# EAGLE design Tracksoar v2 flash (EAGLE 9.0.0)
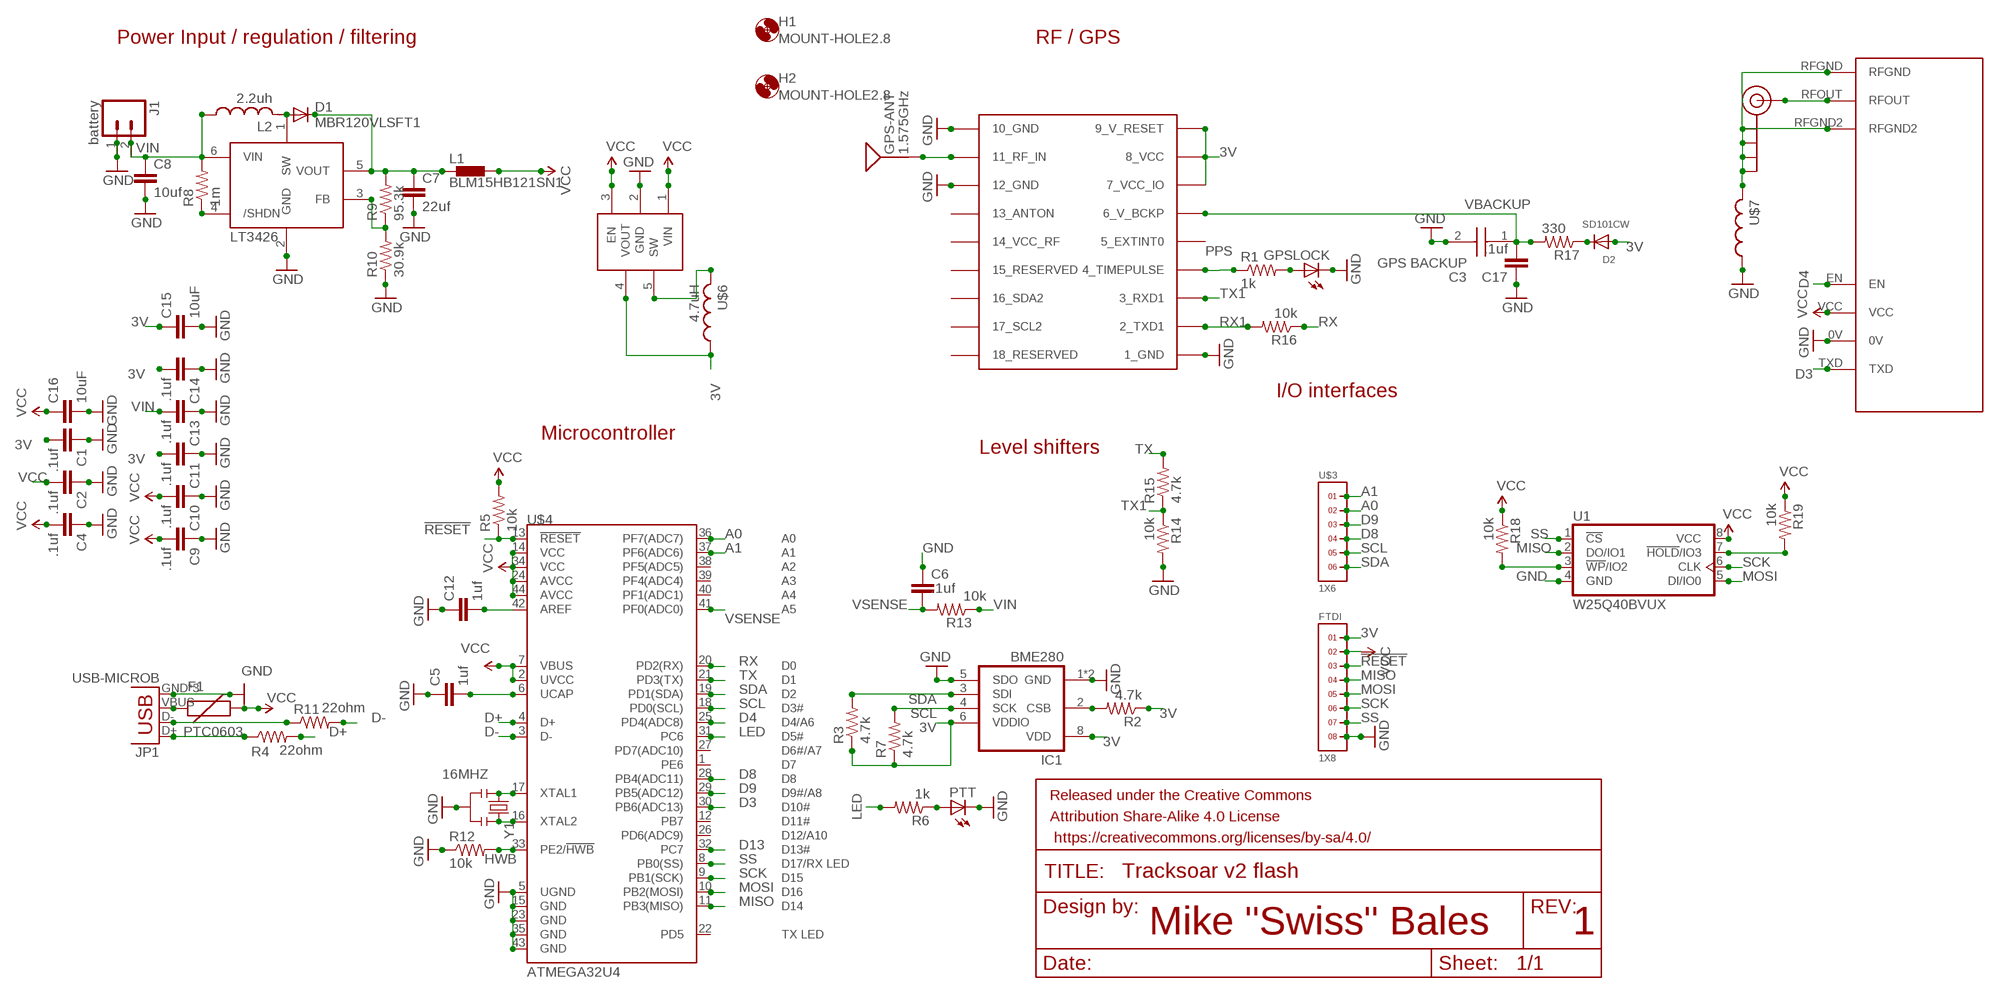
[diagram p0: schematic, sheet 1]

## Parts
C1  .1uf  CAP0402-CAP  [0402-CAP]
C2  .1uf  CAP0402-CAP  [0402-CAP]
C3  GPS BACKUP  DSK-3R3H204T614-H2L  [DSK-3R3H204T614-H2L]
C4  .1uf  CAP0402-CAP  [0402-CAP]
C5  1uf  CAP0402-CAP  [0402-CAP]
C6  .1uf  CAP0402-CAP  [0402-CAP]
C7  22uf  CAP0805  [0805]
C8  10uf  CAP0805  [0805]
C9  .1uf  CAP0402-CAP  [0402-CAP]
C10  .1uf  CAP0402-CAP  [0402-CAP]
C11  .1uf  CAP0402-CAP  [0402-CAP]
C12  1uf  CAP0402-CAP  [0402-CAP]
C13  .1uf  CAP0402-CAP  [0402-CAP]
C14  .1uf  CAP0402-CAP  [0402-CAP]
C15  10uF  10UF-0603-6.3V-20%  [0603]
C16  10uF  10UF-0603-6.3V-20%  [0603]
C17  .1uf  CAP0402-CAP  [0402-CAP]
D1  MBR120VLSFT1  DIODE-SOD123  [SOD123]
D2  SD101CW  DIODESOD-123  [SOD-123]
F1  PTC0603  [0603]
FRAME1  FRAME-LETTER  [CREATIVE_COMMONS]
FTDI  1X8  [1X8]
GPS-ANT  1.575GHz  ANTENNAGPS-2X7MM  [ANT-GPS-2X7MM]
GPSLOCK  LEDCHIP-LED0603  [CHIP-LED0603]
H1  MOUNT-HOLE2.8  [2,8]
H2  MOUNT-HOLE2.8  [2,8]
IC1  BME280  [BME280]
J1  battery  M02JST-PTH-2  [JST-2-PTH]
J$1  SMA_EDGE  [SMA-EDGE]
JP1  USB-MICROB  [USB-MICROB]
L1  BLM15HB121SN1  [0402]
L2  2.2uh  L-USL1812  [L1812]
LT3426  LT3426  [SOT23-6]
PTT  LEDCHIP-LED0603  [CHIP-LED0603]
R1  1k  R-US_R0402  [R0402]
R2  4.7k  R-US_R0402  [R0402]
R3  4.7k  R-US_R0402  [R0402]
R4  22ohm  R-US_R0402  [R0402]
R5  10k  R-US_R0402  [R0402]
R6  1k  R-US_R0402  [R0402]
R7  4.7k  R-US_R0402  [R0402]
R8  1m  R-US_R0402  [R0402]
R9  95.3k  R-US_R0402  [R0402]
R10  30.9k  R-US_R0402  [R0402]
R11  22ohm  R-US_R0402  [R0402]
R12  10k  R-US_R0402  [R0402]
R13  10k  R-US_R0402  [R0402]
R14  10k  R-US_R0402  [R0402]
R15  4.7k  R-US_R0402  [R0402]
R16  10k  R-US_R0402  [R0402]
R17  330  R-US_R0402  [R0402]
R18  10k  R-US_R0402  [R0402]
R19  10k  R-US_R0402  [R0402]
U1  W25Q40BVUX  [USON8]
U$1  UBLOX_MAX  [UBLOX_MAX]
U$2  RADIOMETRIX-HX1  [RADIOMETRIX-HX1]
U$3  1X6  [1X6]
U$4  ATMEGA32U4  ATMEGA32U4QFN2  [QFN-44-NOPAD]
U$5  PAM2305  PAM2305-33SOT23-5  [DBV_R-PDSO-G5]
U$6  4.7uH  INDUCTOR_0805_N  [RESC0805_N]
U$7  INDUCTOR_0402_N  [RESC0402_N]
Y1  16MHZ  RESONATOR16MHZ  [RESONATOR-SMD]

## Nets
3V: C1.2 C11.2 C14.2 C15.1 D2.A FTDI.1 IC1.6(VDDIO) IC1.8(VDD) R2.1 R3.1 R7.1 U$1.7_VCC_IO U$1.8_VCC U$1.9_V_RESET U$5.4(VOUT) U$6.1
!RESET: FTDI.3 R5.1 U$4.13(!RESET)
A0: U$3.2 U$4.36(PF7(ADC7))
A1: U$3.1 U$4.37(PF6(ADC6))
D3: U$2.TXD U$4.30(PB6(ADC13))
D4: U$2.EN U$4.25(PD4(ADC8))
D8: U$3.4 U$4.28(PB4(ADC11))
D9: U$3.3 U$4.29(PB5(ADC12))
D13: U$4.32(PC7)
D+: R4.2 U$4.4(D+)
D-: R11.2 U$4.3(D-)
GND: C1.1 C2.1 C3.2(-) C4.1 C5.1 C6.1 C7.2 C8.2 C9.1 C10.1 C11.1 C12.1 C13.1 C14.1 C15.2 C16.2 C17.1 FTDI.8 GPSLOCK.C IC1.1(GND) IC1.5(SDO) IC1.7(GND) J1.1 JP1.GND JP1.MT1(GND) JP1.MT2(GND) LT3426.2(GND) PTT.C R10.1 R12.1 R14.2 U1.4(GND) U$1.1_GND U$1.10_GND U$1.12_GND U$2.0V U$4.5(UGND) U$4.15(GND) U$4.23(GND) U$4.35(GND) U$4.43(GND) U$5.2(GND) U$7.1 Y1.2
HWB: R12.2 U$4.33(PE2/!HWB)
LED: R6.2 U$4.31(PC6)
MISO: FTDI.4 U1.2(DO/IO1) U$4.11(PB3(MISO))
MOSI: FTDI.5 U1.5(DI/IO0) U$4.10(PB2(MOSI))
N$1: J$1.SIG(SIGNAL) U$2.RFOUT
N$2: IC1.2(CSB) R2.2
N$3: GPSLOCK.A R1.2
N$6: GPS-ANT.1(SIGNAL) U$1.11_RF_IN
N$7: JP1.D- R11.1
N$8: JP1.D+ R4.1
N$9: D1.A L2.2 LT3426.1(SW)
N$12: LT3426.4(/SHDN) R8.1
N$13: LT3426.3(FB) R9.1 R10.2
N$14: F1.1 JP1.VBUS
N$17: C12.2 U$4.42(AREF)
N$19: C7.1 D1.C L1.1 LT3426.5(VOUT) R9.2
N$20: C5.2 U$4.6(UCAP)
N$21: U$5.5(SW) U$6.2
N$22: D2.C R17.1
N$23: R18.2 U1.3(!WP!/IO2)
N$27: PTT.A R6.1
N$28: R19.2 U1.7(!HOLD!/IO3)
PPS: R1.1 U$1.4_TIMEPULSE
RFGND: J$1.GND@0(GND) J$1.GND@1(GND) J$1.GND@2(GND) J$1.GND@3(GND) U$2.RFGND U$2.RFGND2 U$7.2
RX: R16.1 U$4.20(PD2(RX))
RX1: R16.2 U$1.2_TXD1
SCK: FTDI.6 U1.6(CLK) U$4.9(PB1(SCK))
SCL: IC1.4(SCK) R7.2 U$3.5 U$4.18(PD0(SCL))
SDA: IC1.3(SDI) R3.2 U$3.6 U$4.19(PD1(SDA))
SS: FTDI.7 U1.1(!CS!) U$4.8(PB0(SS))
TX: R15.2 U$4.21(PD3(TX))
TX1: R14.1 R15.1 U$1.3_RXD1
VBACKUP: C3.1(+) C17.2 R17.2 U$1.6_V_BCKP
VCC: C2.2 C4.2 C9.2 C10.2 C16.1 F1.2 FTDI.2 L1.2 R5.2 R18.1 R19.1 U1.8(VCC) U$2.VCC U$4.2(UVCC) U$4.7(VBUS) U$4.14(VCC) U$4.24(AVCC) U$4.34(VCC) U$4.44(AVCC) U$5.1(VIN) U$5.3(EN)
VIN: C8.1 C13.2 J1.2 L2.1 LT3426.6(VIN) R8.2 R13.1
VSENSE: C6.2 R13.2 U$4.41(PF0(ADC0))
XTAL1: U$4.17(XTAL1) Y1.1
XTAL2: U$4.16(XTAL2) Y1.3
Unconnected: U$1.5_EXTINT0 U$1.13_ANTON U$1.14_VCC_RF U$1.15_RESERVED U$1.16_SDA2 U$1.17_SCL2 U$1.18_RESERVED U$4.1(PE6) U$4.12(PB7) U$4.22(PD5) U$4.26(PD6(ADC9)) U$4.27(PD7(ADC10)) U$4.38(PF5(ADC5)) U$4.39(PF4(ADC4)) U$4.40(PF1(ADC1))

## Notes on the sheet
- Power Input / regulation / filtering | RF / GPS
- I/O interfaces
- Microcontroller
- Level shifters
- Mike "Swiss" Bales | 1

## Library data of the parts
C1 C2 C4 C5 C7-C14 C17 = SparkFun-Capacitors:CAP: Capacitor Standard 0603 ceramic capacitor, and 0.1" leaded capacitor.
C3 = DSK-3R3H204T614-H2L:DSK-3R3H204T614-H2L: Coin cell capacitor Source: Datasheet <http://www.elna.co.jp/en/capacitor/double_layer/catalog/pdf/ds_e.pdf>; ARROW_PART_NUMBER: DSK-3R3H204T614-H2L; DESCRIPTION: Coin cell capacitor; HEIGHT: mm; MANUFACTURER_NAME: Elna; MANUFACTURER_PART_NUMBER: DSK-3R3H204T614-H2L
C6 = SparkFun-Passives:CAP: Capacitor Standard 0603 ceramic capacitor, and 0.1" leaded capacitor.
C15 C16 = SparkFun-Capacitors:10UF: 10.0µF ceramic capacitors A capacitor is a passive two-terminal electrical component used to store electrical energy temporarily in an electric field.; PROD_ID: CAP-11015
D1 = diode:DIODE-: DIODE
D2 = adafruit:DIODE: Diode SMADIODE - SMA Surface Mount Package 20V 1A Schottky Diode Digikey: 641-1014-6-ND DO-1N4148 - Through Hole Small Current Diode SOD-123 20V 1 A (.5mV Vf) Schottky Diode - Digikey: MBRX120TPMSCT-ND SOD-323 10V 570mA (.38mV Vf, 3ns) Schottky Diode - Digikey: ZLLS410CT-ND SOD-523 30V 30mA Schottky Diode (RB751S-40TE61) - Digikey: RB751S-40TE61CT-ND SOT23-R/W - SOT23 Package (R = Solder Paste/Reflow Ovens, W = Hand-Soldering) BAT54Film 40V 300mA - Digikey: 497-7162-1-ND
F1 = SparkFun-PowerIC:PTC: Resettable Fuse PTC Resettable Fuse. Spark Fun Electronics SKU : COM-08357
FRAME1 = SparkFun-Aesthetics:FRAME-LETTER: Schematic Frame Standard 8.5x11 US Letter frame
FTDI = headers(2mm):1X8
GPS-ANT = SparkFun-GPS:ANTENNA: Single-ended Antennae 1.575GHz antennae with just one terminal. These are all chip antennae. 1575MHz (GPS) Antennae ANT-GPS-2X7MM - 2.0 x 7.0 mm chip antenna. (SparkFun Product <https://www.sparkfun.com/products/9131>) ANT-GPS-2X8MM - 2.0 x 8.0 mm chip antenna. (SparkFun Product <https://www.sparkfun.com/products/8418>); PROD_ID: ANT-09087; SF_ID: GPS-09131
GPSLOCK PTT = adafruit:LED: LED OSRAM: - CHIPLED LG R971, LG N971, LY N971, LG Q971, LY Q971, LO R971, LY R971 LH N974, LH R974 LS Q976, LO Q976, LY Q976 LO Q996 - Hyper CHIPLED LW Q18S LB Q993, LB Q99A, LB R99A - SideLED LS A670, LO A670, LY A670, LG A670, LP A670 LB A673, LV A673, LT A673, LW A673 LH A674 LY A675 LS A676, LA A676, LO A676, LY A676, LW A676 LS A679, LY A679, LG A679 - Hyper Micro SIDELED® LS Y876, LA Y876, LO Y876, LY Y876 LT Y87S - SmartLED LW L88C, LW L88S LB L89C, LB L89S, LG L890 LS L89K, LO L89K, LY L89K LS L896, LA L896, LO L896, LY L896 - TOPLED LS T670, LO T670, LY T670, LG T670, LP T670 LSG T670, LSP T670, LSY T670, LOP T670, LYG T670 LG T671, LOG T671, LSG T671 LB T673, LV T673, LT T673, LW T673 LH T674 LS T676, LA T676, LO T676, LY T676, LB T676, LH T676, LSB T676, LW T676 LB T67C, LV T67C, LT T67C, LS T67K, LO T67K, LY T67K, LW E67C LS E67B, LA E67B, LO E67B, LY E67B, LB E67C, LV E67C, LT E67C LW T67C LS T679, LY T679, LG T679 LS T770, LO T770, LY T770, LG T770, LP T770 LB T773, LV T773, LT T773, LW T773 LH T774 LS E675, LA E675, LY E675, LS T675 LS T776, LA T776, LO T776, LY T776, LB T776 LHGB T686 LT T68C, LB T68C - Hyper Mini TOPLED® LB M676 - Mini TOPLED Santana® LG M470 LS M47K, LO M47K, LY M47K Source: http://www.osram.convergy.de/
H1 H2 = holes:MOUNT-HOLE: MOUNTING HOLE with drill center marker
IC1 = bosch-bme280:BME280: DIGITAL HUMIDITY, PRESSURE AND TEMPERATURE SENSOR * Digital interface I²C (up to 3.4 MHz) and SPI (3 and 4 wire, up to 10 MHz)* Supply voltage VDD main supply voltage range: 1.71 V to 3.6 V*VDDIO interface voltage range: 1.2 V to 3.6 V Operating range -40…+85 °C, 0…100 % rel. humidity, 300…1100 hPa The library has been designed by Richard Magdycz <https://www.facebook.com/groups/eaglecadsoftUK>
J1 = SparkFun-Connectors:M02: Standard 2-pin 0.1" header. Use with - straight break away headers ( PRT-00116) - right angle break away headers (PRT-00553) - swiss pins (PRT-00743) - machine pins (PRT-00117) - female headers (PRT-00115) Molex polarized connector foot print use with: PRT-08233 with associated crimp pins and housings. 2.54_SCREWTERM for use with PRT-10571. 3.5mm Screw Terminal footprints for PRT-08084 5mm Screw Terminal footprints for use with PRT-08432; PROD_ID: CONN-09863; SKU: PRT-09914
J$1 = SparkFun-Connectors:SMA_EDGE: SMA Antenna Connector End launch SMA connector. The paste layer has been removed so that the connector can be hand soldered onto the board after reflow.
JP1 = SparkFun-Connectors:USB: USB Connectors USB-B-PTH is fully proven SKU : PRT-00139/CONN-08278 USB-miniB is fully proven SKU : PRT-00587 USB-A-PCB is untested. USB-A-H is throughly reviewed, but untested. Spark Fun Electronics SKU : PRT-00437 USB-B-SMT is throughly reviewed, but untested. Needs silkscreen touching up. USB-A-S has not been used/tested USB-MB-H has not been used/tested USB-MICROB has been used. CONN-09505; PROD_ID: CONN-09505
L1 = inductors:BLM15H: EMIFIL (R) Chip Ferrite Bead for GHz Noise Source: http://www.murata.com/ Ferrite Bead BLM15H.pdf
L2 = resistor:L-US: INDUCTOR, American symbol
LT3426 = adafruit:LT3426: LT3426 1.2MHz, 2A boost converter in SOT-23 http://www.linear.com/pc/productDetail.jsp?navId=H0,C1,C1003,C1042,C1031,C1061,P8430 (Linear website)
R1-R19 = adafruit:R-US_: RESISTOR, American symbol
U1 = memory-winbond:W25Q40BV: EEPROM 4 Mbit SPI Serial Flash with Dual and Quad SPI
U$1 = Ava:UBLOX_MAX: UBLOX MAX
U$2 = Ava:RADIOMETRIX-HX1
U$3 = headers(2mm):1X6
U$4 = SparkFun-DigitalIC:ATMEGA32U4: Atmel 44-pin 8-bit Microcontroller with 32KBytes of ISP Flash and USB Controller
U$5 = PAM2305-33:PAM2305-33
U$6 U$7 = Nordic_nRF:INDUCTOR: Generic chip inductor
Y1 = SparkFun-FreqCtrl:RESONATOR: Resonator Small SMD resonator. Used, eg, on the Arduino Pro/ Pro Mini boards. 8MHz- XTAL-08895 16MHz- XTAL-08900; PROD_ID: XTAL-08900

## Board
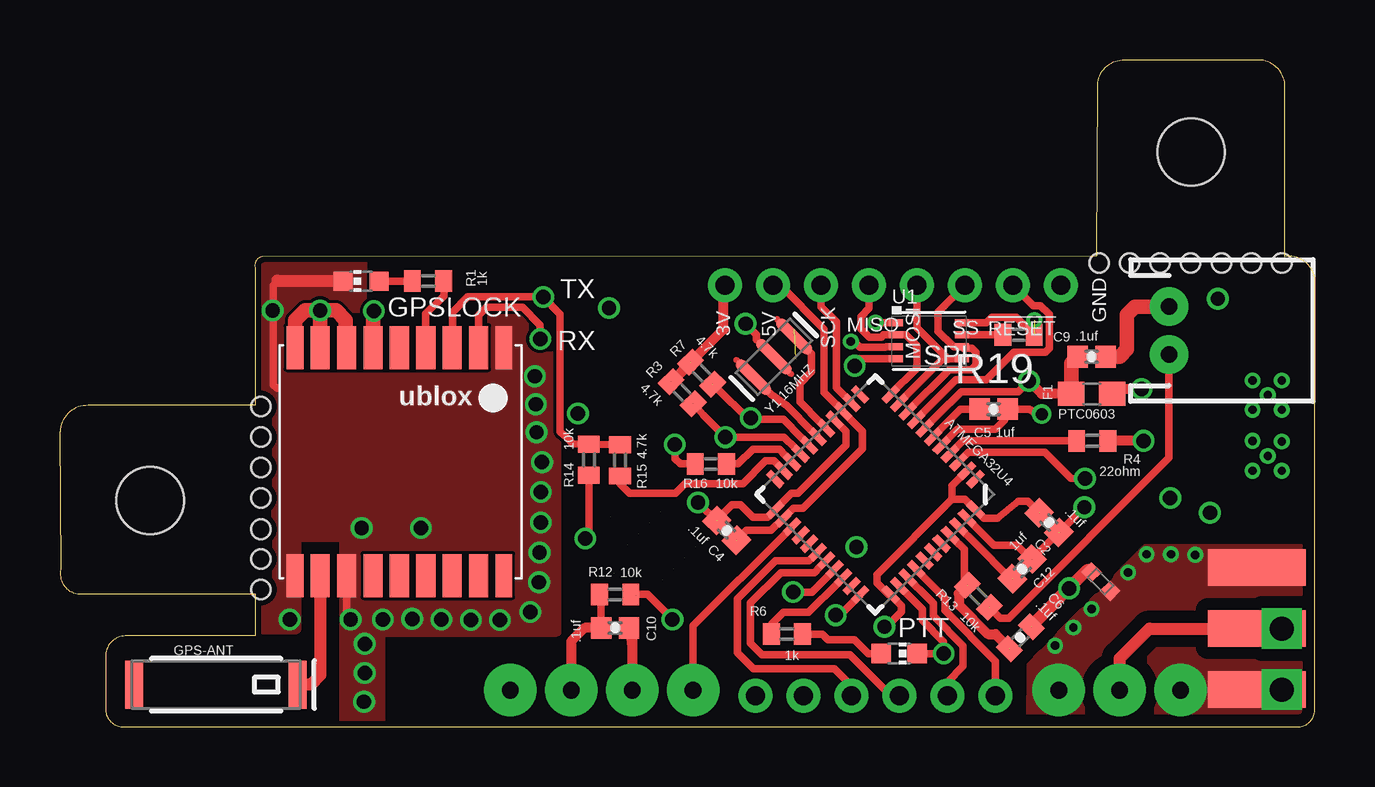
[diagram p1: board, top side]
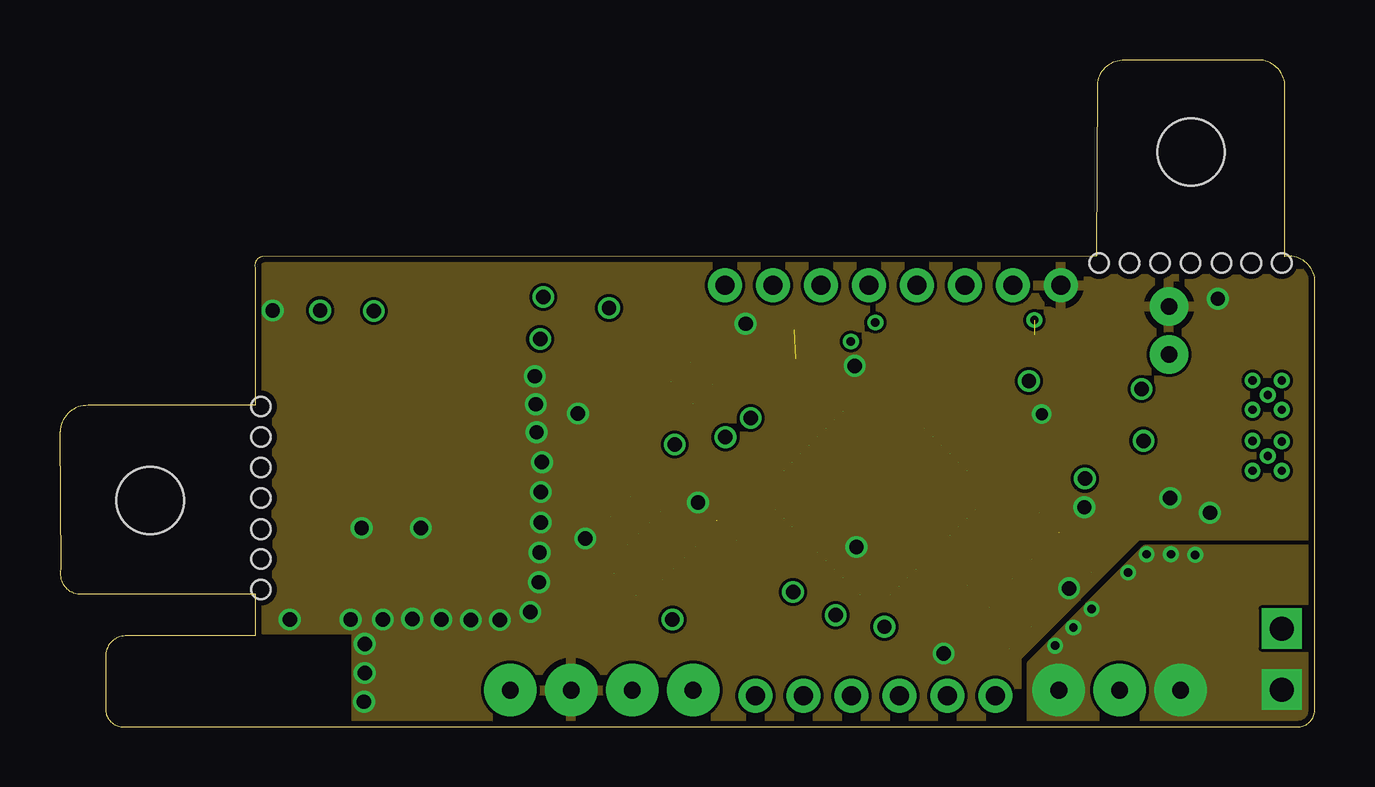
[diagram p2: board, inner layer Route2]
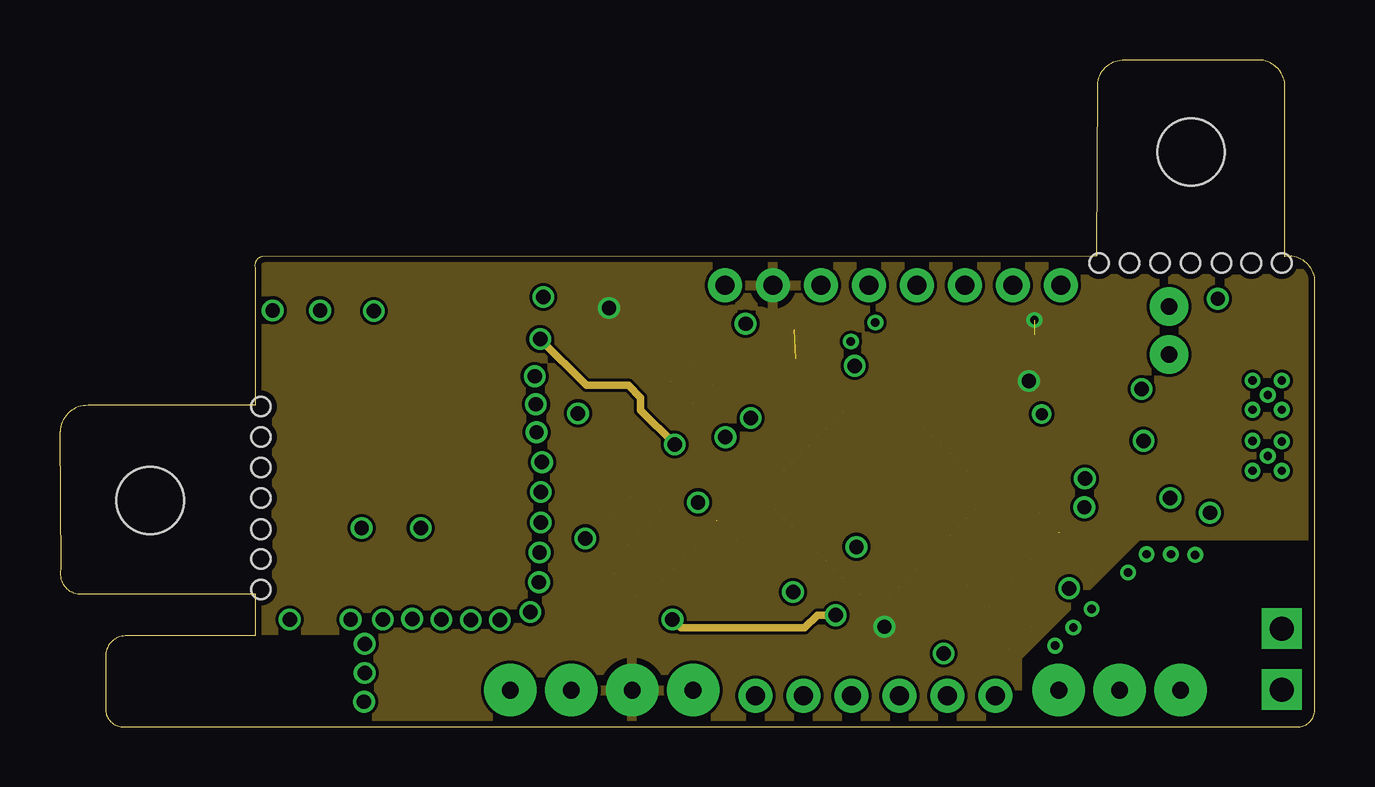
[diagram p3: board, inner layer Route15]
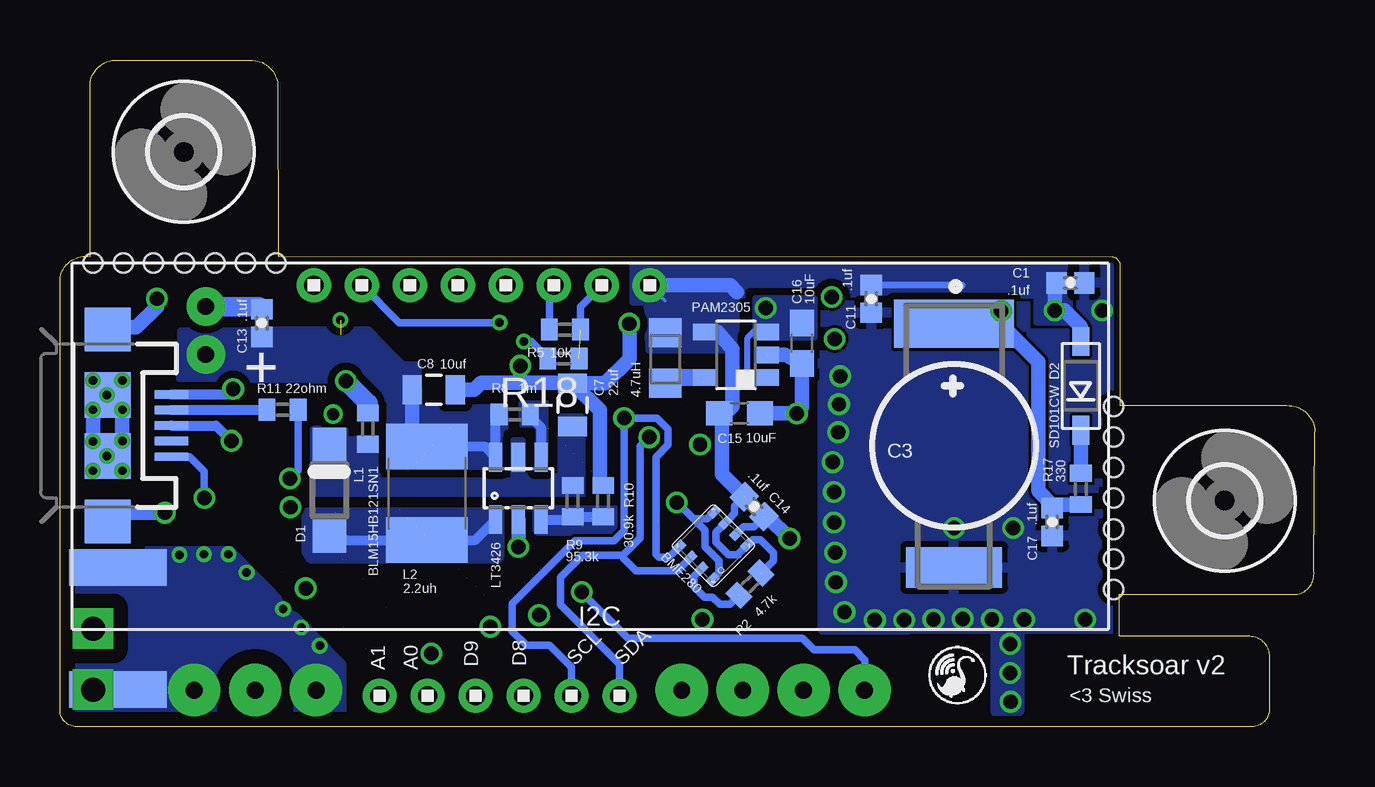
[diagram p4: board, bottom side, seen from below]

Size 52.31 x 27.78 mm. Coordinates in mm from the lower left corner, seen from the top.
Outline: 51.69,0 arc90 52.3,0.81 52.3,18.72 arc90 51.05,19.58 51.05,26.85 arc90 49.73,27.76 44.37,27.76 arc90 43.23,26.75 43.21,19.69 arc-90 43.18,19.61 8.43,19.58 arc90 8.13,19.15 8.13,13.39 1.17,13.39 arc90 0,12.29 0.05,6.55 arc90 0.74,5.51 8.15,5.51 8.15,3.78 2.72,3.78 arc90 1.9,2.92 1.9,0.84 arc90 2.54,0 51.69,0
Copper layers (1*2*15*16): Top 0.035mm / dielectric 0.23mm / Route2 0.035mm / dielectric 0.93mm / Route15 0.035mm / dielectric 0.23mm / Bottom 0.035mm
Design rules "MF_Standard_4_Layer": minimum track width 5mil, minimum drill 12mil, track to track 5mil, track to pad 5mil, pad to pad 5mil, via to via 5mil, smd to smd 0mil, copper to edge 10mil, drill to drill 10mil, minimum pad ring 6mil, minimum via ring 6mil, stop-mask expansion 2mil, vias tented up to drill 25mil, thermal gap 10mil
Holes 0.8 mm at 50.93,19.33 49.66,19.33 48.41,19.33 47.12,19.33 45.85,19.33 44.58,19.33 43.31,19.33 8.38,5.71 8.38,6.98 8.38,8.23 8.38,9.53 8.38,10.8 8.38,12.07 8.38,13.34

### Footprints (pad centres in the part's own frame; a part is rotated, then mirrored left to right if it is on the bottom)
0402-CAP = smd 0.85 x 0.9: 1 -0.58,0; 2 0.58,0
DSK-3R3H204T614-H2L = smd 5 x 2: 1 0,5.075 | smd 4 x 1.7: 2 0,-5.075
0402-CAP' = smd 0.7 x 0.9: 1 -0.65,0; 2 0.65,0
0805 = smd 0.8 x 1.2: 1 -0.9,0; 2 0.9,0
0603 = smd 1.1 x 1: 1 -0.85,0; 2 0.85,0
SOD123 = smd 1.4 x 1.4: A 1.9,0; C -1.9,0
SOD-123 = smd 1.2 x 0.7: A 1.85,0; C -1.85,0
1X8 = drill 0.8 pad 1.422: 1 -7,0; 2 -5,0; 3 -3,0; 4 -1,0; 5 1,0; 6 3,0; 7 5,0; 8 7,0
ANT-GPS-2X7MM = smd 0.75 x 2: 1 -3.4,0; NC 3.4,0
CHIP-LED0603 = smd 0.8 x 0.8: A 0,-0.75; C 0,0.75
2,8 = hole 2.8: 0,0
BME280 = smd 0.35 x 0.5: 1 0.975,-1.025; 2 0.325,-1.025; 3 -0.325,-1.025; 4 -0.975,-1.025; 5 -0.975,1.025; 6 -0.325,1.025; 7 0.325,1.025; 8 0.975,1.025
JST-2-PTH = drill 0.7 pad 1.6: 1 -1,0; 2 1,0
SMA-EDGE = smd 1.524 x 4.064: GND@0 0,0; GND@1 5.08,0; SIG 2.54,0 | smd 1.524 x 4.064 bottom: GND@2 0,0; GND@3 5.08,0
USB-MICROB = smd 0.35 x 1.4: D+ 0,2.65; D- -0.65,2.65; GND 1.3,2.65; ID 0.65,2.65; VBUS -1.3,2.65 | smd 1.8 x 1.9: MT1 -4,0; MT2 4,0 | smd 1.9 x 1.9: P$1 -1.27,0; P$2 1.27,0
0402 = smd 0.7 x 0.9: 1 -0.65,0; 2 0.65,0
L1812 = smd 1.9 x 3.4: 1 -1.95,0; 2 1.95,0
SOT23-6 = smd 0.55 x 1.2: 1 -0.95,-1.3; 2 0,-1.3; 3 0.95,-1.3; 4 0.95,1.3; 5 0,1.3; 6 -0.95,1.3
R0402 = smd 0.7 x 0.9: 1 -0.65,0; 2 0.65,0
USON8 = smd 0.3 x 0.6: 1 -0.75,-1.375; 2 -0.25,-1.375; 3 0.25,-1.375; 4 0.75,-1.375; 5 0.75,1.375; 6 0.25,1.375; 7 -0.25,1.375; 8 -0.75,1.375
UBLOX_MAX = smd 1.8 x 0.7: 1_GND 4.95,-4.4; 9_V_RESET 4.95,4.3; 10_GND -4.55,4.3; 18_RESERVED -4.55,-4.4 | smd 1.8 x 0.8: 2_TXD1 4.95,-3.35; 3_RXD1 4.95,-2.25; 4_TIMEPULSE 4.95,-1.15; 5_EXTINT0 4.95,-0.05; 6_V_BCKP 4.95,1.05; 7_VCC_IO 4.95,2.15; 8_VCC 4.95,3.25; 11_RF_IN -4.55,3.25; 12_GND -4.55,2.15; 13_ANTON -4.55,1.05; 14_VCC_RF -4.55,-0.05; 15_RESERVED -4.55,-1.15; 16_SDA2 -4.55,-2.25; 17_SCL2 -4.55,-3.35
RADIOMETRIX-HX1 = drill 0.7 pad 2.184: 0V 8.89,-10.16; EN 3.81,-10.16; RFGND -11.43,-10.16; RFGND2 -16.51,-10.16; RFOUT -13.97,-10.16; TXD 11.43,-10.16; VCC 6.35,-10.16
1X6 = drill 0.8 pad 1.422: 1 -5,0; 2 -3,0; 3 -1,0; 4 1,0; 5 3,0; 6 5,0
QFN-44-NOPAD = smd 0.8 x 0.3: 1 -3.4,2.5; 2 -3.4,2; 3 -3.4,1.5; 4 -3.4,1; 5 -3.4,0.5; 6 -3.4,0; 7 -3.4,-0.5; 8 -3.4,-1; 9 -3.4,-1.5; 10 -3.4,-2; 11 -3.4,-2.5; 23 3.4,-2.5; 24 3.4,-2; 25 3.4,-1.5; 26 3.4,-1; 27 3.4,-0.5; 28 3.4,0; 29 3.4,0.5; 30 3.4,1; 31 3.4,1.5; 32 3.4,2; 33 3.4,2.5 | smd 0.3 x 0.8: 12 -2.5,-3.4; 13 -2,-3.4; 14 -1.5,-3.4; 15 -1,-3.4; 16 -0.5,-3.4; 17 0,-3.4; 18 0.5,-3.4; 19 1,-3.4; 20 1.5,-3.4; 21 2,-3.4; 22 2.5,-3.4; 34 2.5,3.4; 35 2,3.4; 36 1.5,3.4; 37 1,3.4; 38 0.5,3.4; 39 0,3.4; 40 -0.5,3.4; 41 -1,3.4; 42 -1.5,3.4; 43 -2,3.4; 44 -2.5,3.4
DBV_R-PDSO-G5 = smd 0.69 x 0.99: 1 -0.95,-1.29; 2 0,-1.29; 3 0.95,-1.29; 4 0.95,1.3; 5 -0.95,1.3
RESC0805_N = smd 1.2 x 1.35: 1 -1.1,0; 2 1,0
RESC0402_N = smd 0.6 x 0.6: 1 -0.55,0; 2 0.55,0
RESONATOR-SMD = smd 0.45 x 1.905: 1 -1.2,0; 2 0,0; 3 1.2,0

### Placement (x,y rotation side)
C1  10.19,18.49 180 bottom
C2  41.22,8.51 135 top
C3  15.04,11.71 0 bottom
C4  27.79,8.18 315 top
C5  38.91,13.23 180 top
C6  .1uf  [0402-CAP']  40.03,3.71 225 top
C7  30.94,13.41 90 bottom
C8  36.73,14.05 0 bottom
C9  43,15.42 180 top
C10  23.14,4.11 0 top
C11  18.49,17.83 90 bottom
C12  40.11,6.58 225 top
C13  43.89,16.81 270 bottom
C14  23.37,9.17 135 bottom
C15  23.98,13.06 0 bottom
C16  21.39,15.98 270 bottom
C17  10.95,8.53 90 bottom
D1  41.07,9.86 270 bottom
D2  9.75,14.2 90 bottom
F1  43,13.87 180 top
FRAME1  -1.07,-13.72 0 top  (outside the outline)
FTDI  34.72,18.39 180 bottom
GPS-ANT  6.5,1.75 180 top
GPSLOCK  12.55,18.57 90 top
H1  47.14,23.95 0 bottom
H2  3.76,9.42 0 bottom
IC1  25.07,7.54 315 bottom
J1  46.23,16.51 270 top
J$1  49.89,1.55 90 top
JP1  50.32,12.55 270 bottom
L1  39.47,12.42 90 bottom
L2  37.01,9.73 270 bottom
LT3426  33.2,9.93 0 bottom
PTT  34.98,3.05 270 top
R1  15.34,18.57 180 top
R2  23.55,5.94 225 bottom
R3  25.93,13.92 315 top
R4  43.03,11.91 180 top
R5  31.26,16.55 0 bottom
R6  30.3,3.86 180 top
R7  26.75,14.73 315 top
R8  33.35,13 180 bottom
R9  30.94,9.4 90 bottom
R10  29.67,9.4 270 bottom
R11  43.03,13.21 0 bottom
R12  23.14,5.51 0 top
R13  38.28,5.44 135 top
R14  22.05,11.13 270 top
R15  23.34,11.1 270 top
R16  27.13,10.95 180 top
R17  9.75,9.91 270 bottom
R18  31.32,15.34 180 bottom
R19  39.95,16.33 180 top
U1  36.22,16.08 270 top
U$1  14.1,10.85 90 top
U$2  30.2,11.68 0 bottom
U$3  33.99,1.3 0 bottom
U$4  33.99,9.68 225 top
U$5  24.13,15.49 90 bottom
U$6  27.08,15.32 270 bottom
U$7  43.38,6.05 315 top
Y1  29.76,15.42 45 top

### Tracks (layer width: path | path; a pad name or v marks a point on that pad's centre or on a via)
3V  (via drill 0.6)  (6 unrouted)
  Top 0.305: U$1.8_VCC | 27.66,18.13 FTDI.1 | R3.1 25.5,14.38 25.93,14.81 | R7.1 26.73,15.64
  Top 0.406: R3.1 25.93,14.81 R7.1 26.73,15.64 27.66,16.56 27.66,18.13
  Top 0.61: v10.85,17.35 U$1.8_VCC | U$1.9_V_RESET 9.8,16.93 10.21,17.35 v10.85,17.35 | U$1.7_VCC_IO 11.91,15.83 11.91,16.94 11.51,17.35 v10.85,17.35
  Bottom 0.152: 27.05,16.44 U$6.1 | 27.08,17.74 FTDI.1
  Bottom 0.305: v10.84,17.36 v10.85,17.35 | 22.96,6.53 22.55,6.91 22.55,7.24 23.11,7.8 23.44,7.8 23.54,7.69 IC1.8 24.03,7.21 24.03,7.16 24.43,7.16 24.97,7.7 24.97,8.11 IC1.6 24.46,8.61 24.18,8.89 24.18,9.18 C14.2 24,9.81 | 22.96,6.53 R2.1 22.96,6.53 | 14.72,18.4 C11.2 | 10.79,18.51 C1.2
  Bottom 0.61: C1.2 10.85,18.49 v10.85,17.36 v10.84,17.36 10.45,17.36 9.75,16.66 D2.A | C14.2 24,9.81 24.72,10.53 24.72,12.9 | 24.08,18.11 24.36,18.39 FTDI.1 | 24.72,12.9 24.28,13.36 24.28,15.72 24.89,16.46 24.91,16.44 U$5.4 | C15.1 24.83,13.01 24.72,12.9
  pour Bottom (isolate 0.305, rank 3, no thermals): 28.42,19.33 10.24,19.33 10.24,16.87 11.58,16.87 11.58,18.01 24.13,18.01 24.13,15.7 27.76,15.7 27.81,17.7 28.42,17.7
!RESET
  Top 0.305: U$4.13 32.36,14.13 32.36,16.87 31.72,17.5 FTDI.3
  Bottom 0.305: FTDI.3 31.91,18.2 R5.1
A0  (1 unrouted)
  Top 0.152: 35.5,6.04 U$4.36 35.52,6.03
  Top 0.305: U$3.2 36.98,1.86 37.64,2.51 37.64,3.38 36.4,4.62 36.4,5.14 36.21,5.33 U$4.36 35.63,5.91
A1  (1 unrouted)
  Top 0.305: U$3.1 38.98,2.72 36.88,4.85 36.88,5.36 U$4.37
D3  (via drill 0.6)  (1 unrouted)
  Top 0.254: U$4.30 32.07,6.35 32.07,6.34
  Top 0.305: U$4.30 32.07,6.34 31.34,5.61 v30.56,5.61
  Bottom 0.305: v30.56,5.61 28.63,3.68 21.36,3.68 20.88,3.2 19.18,3.2 18.74,2.77 18.74,1.55 U$2.TXD
D4  (1 unrouted)
  Top 0.254: U$4.25 30.3,8.11 | 30.3,8.11
  Top 0.305: U$4.25 30.3,8.11 26.39,4.2 U$2.EN
D8  (1 unrouted)
  Top 0.305: U$4.28 31.34,7.04 31.22,6.91 29.82,6.91 28.24,5.33 28.24,3.07 28.9,2.41 32.28,2.41 32.98,1.71 U$3.4
D9  (1 unrouted)
  Top 0.305: U$4.29 31.67,6.66 31.44,6.43 30.05,6.43 28.78,5.16 28.78,3.48 29.26,3 32.93,3 34.65,1.27 U$3.3
D+  (1 unrouted)
  Top 0.305: R4.2 37.63,11.91 37.26,11.54 U$4.4
D-  (via drill 0.6)  (1 unrouted)
  Top 0.305: v42.72,10.34 42.14,10.36 41.05,11.43 37.86,11.43 37.67,11.25 U$4.3
  Bottom 0.305: 42.44,13.14 R11.2 42.38,10.68 v42.72,10.34
GND  (via drill 0.5, 0.6)  (14 unrouted)
  Top 0.152: Y1.2 29.04,16.13
  Top 0.254: U$4.23 29.79,9.04 29.69,8.94 | C6.1 40.49,4.19 40.75,4.46 | C2.1 41.65,8.1 41.93,8.38
  Top 0.305: U$4.15 32.52,12.56 32.77,12.31 32.77,11.73 30.76,9.73 30.48,9.73 29.81,9.06 | 29.81,9.06 U$4.23 | v28.57,16.79 29.04,16.32 29.04,16.13 | 40.43,7.01 C12.1 | 29.81,9.06 29.69,8.94 29.49,8.74 28.88,8.74 28.37,9.25 28.02,9.25 27.38,8.61 C4.1 26.89,9.04 v26.59,9.35 | R12.1 22.56,5.76 C10.1 | C12.1 40.46,6.99 39.88,7.57 38.92,7.57 U$4.43 38.07,8.42 | R14.2 22.05,8 v21.89,7.85 | PTT.C v36.83,3.05 36.83,3.54 35.94,4.43 35.94,4.89 35.53,5.3 U$4.35 | 9.09,18.57 8.89,18.36 8.89,14.25 9.04,14.1 | U$1.12_GND 11.95,4.66 v12.12,4.47 | v40.92,13.03 40.74,13.03 40.41,13.23 C5.1 39.36,12.77 38.99,12.4 37.41,12.4 37.16,12.14 U$4.5 | v42.7,9.14 41.93,8.38 C2.1 41.3,7.78 C12.1 | U$7.1 42.93,6.43 42.83,6.54 | U1.4 33.34,15.33 v33.12,15.04
  Top 0.406: C10.1 21.87,4.11 21.31,3.56 U$2.0V | C6.1 40.54,4.24
  Top 0.508: 40.54,4.24 40.75,4.46 v42.06,5.77 | 42.06,5.79 v42.06,5.77 | GPSLOCK.C 9.09,18.57 9.07,18.59 | v42.06,5.77 42.83,6.54 U$7.1
  Top 0.61: C9.1 44.17,15.42 44.48,15.72 44.48,17.17 44.81,17.5 J1.1
  Bottom 0.305: 24.98,6.27 IC1.1 25.1,6.14 24.98,6.27 | 24.98,6.27 24.83,6.41 24.83,6.91 25.43,7.51 25.43,8.18 25.91,8.66 | 25.91,8.66 v26.59,9.35 | 25.15,8.84 IC1.5 25.15,8.84 | 25.15,8.84 25.33,8.66 25.91,8.66 | 22.71,8.51 C14.1 22.96,8.74 23.37,8.33 23.82,8.33 24.01,8.14 IC1.7 | 19.79,14.8 v19.79,14.61 | JP1.GND 46.91,11.25 46.3,10.64 46.3,9.55 v46.28,9.53 | 25.15,8.84
  Bottom 0.508: JP1.MT2 49.95,8.92
  Bottom 0.61: R10.1 29.79,10.05 29.79,13.19 C7.2 | C8.2 35.05,14.05 34.75,14.33 33.12,14.33 | 33.12,14.33 31.08,14.33 C7.2 | U$5.2 22.08,15.49 C16.2 21.39,13.31 21.64,13.06 | C14.1 22.81,8.76 v21.89,7.85 | 49.95,8.92 v47.93,8.92 | JP1.MT1 50.23,16.64 49.12,16.64 48.26,17.5 v48.26,17.83 | C15.2 21.64,13.06 | 21.64,13.06 v21.59,13.06 | v33.12,15.04 33.12,14.33 | LT3426.2 v33.2,7.49 | C7.2 29.58,14.31 28.57,15.32 v28.57,16.79
  Bottom 0.813: 46.24,17.53 J1.1 45.63,17.51 45.62,17.5 44,17.5 C13.1
  other vias: 19.99,7.26 19.96,6.02 19.61,4.78 12.7,2.24 12.7,3.45 9.58,4.47 12.67,1.04 18.34,4.45 17.12,4.45 15.9,4.47 14.68,4.5 13.46,4.47 20.04,8.51 20.04,9.78 20.09,11.02 19.86,12.27 19.84,13.44 15.04,8.28 12.57,8.28 8.86,17.35
  pour Route2: 52.32,19.56 25.96,19.61 19.99,19.56 8.46,19.56 8.46,4.06 12.34,4.06 12.34,0.15 39.88,0 39.88,2.92 44.93,7.98 52.25,7.98
  pour Bottom (rank 4): 20.5,19.53 8.43,19.58 8.43,4.06 12.32,4.06 12.32,0.64 13.28,0.64 13.28,0.61 13.31,0.61 13.31,4.06 20.5,4.01
  pour Top (no thermals): 20.7,19.53 8.43,19.58 8.43,4.06 9.86,4.06 9.86,7.87 9.98,7.92 11.81,7.92 11.84,7.82 11.84,0.03 13.36,0.03 13.36,3.96 20.7,3.96
HWB  (via drill 0.6)  (1 unrouted)
  Top 0.254: U$4.33 33.11,5.27 33.11,5.25
  Top 0.305: U$4.33 33.35,5.49 33.11,5.25 32.51,4.65 v32.33,4.65 | R12.2 24.49,5.51 v25.53,4.47
  Route15 0.305: v32.33,4.65 31.57,4.65 31.04,4.11 25.88,4.11 v25.53,4.47
LED  (1 unrouted)
  Top 0.254: U$4.31 32.42,5.99 | 32.42,5.99
  Top 0.305: U$4.31 32.42,5.99 31.2,4.78 30.15,4.78 29.65,4.28 R6.2
MISO
  Top 0.305: U$4.11 35.71,14.94 35.71,15.88 35.26,16.33 U1.2 34.33,16.33 34.24,16.23 33.73,16.23 33.38,16.59 33.38,16.94 33.38,16.98 33.38,17.09 33.72,17.44 FTDI.4
MOSI
  Top 0.305: FTDI.5 35.72,16.63 37.03,15.32 37.04,15.33 | 37.04,15.33 U1.5 | U$4.10 36.81,15.33 37.04,15.33
N$1
  Top 0.305: J$1.SIG 50.95,4.09 50.95,4.14
  Top 0.508: U$2.RFOUT 44.17,2.84 45.41,4.09 50.95,4.09
N$2  (2 unrouted)
  Bottom 0.305: IC1.2 25.68,6.48 25.88,6.27 25.88,5.84 25.45,5.41 25.1,5.41 24.8,5.11 24.38,5.11 24.12,5.37 R2.2
N$3
  Top 0.305: GPSLOCK.A R1.2
N$6
  Top 0.305: U$1.11_RF_IN 10.81,6.26
  Top 0.508: U$1.11_RF_IN 10.85,2.16 10.44,1.75 GPS-ANT.1
N$7
  Bottom 0.406: JP1.D- R11.1
N$8  (via drill 0.6)
  Top 0.406: v45.16,11.91 R4.1
  Bottom 0.406: JP1.D+ 45.8,12.55 v45.16,11.91
N$9
  Bottom 0.406: D1.A 40.39,7.78 L2.2 35,7.78 LT3426.1
  pour Bottom (no thermals): 41.96,8.84 34.49,8.84 34.21,8.89 34.09,8.92 34.09,7.11 41.81,7.11 41.94,7.32 41.94,8.41
N$12
  Bottom 0.406: R8.1 32.7,12.91 32.26,12.47 32.26,11.24 LT3426.4
  pour Bottom (isolate 0.406, rank 3, no thermals): 32.44,12.57 32.99,12.57 32.99,12.67 33.05,13.46 32,13.46 31.98,13.41 31.98,10.82 32.41,10.82
N$13
  Bottom 0.406: LT3426.3 30.94,8.63 R9.1 R10.2
  pour Bottom (rank 5, no thermals): 32.31,8.97 29.16,8.92 29.11,8.81 29.08,8.41 29.06,8.26 32.03,8.26 32.31,8.23
N$14  (via drill 0.6)
  Top 0.406: v45.08,14.07 43.98,14.07 F1.1
  Bottom 0.406: JP1.VBUS 45.41,13.85 v45.08,14.07
N$17  (2 unrouted)
  Top 0.254: C12.2 39.62,6.17 39.55,6.23
  Top 0.305: C12.2 39.67,6.11 39.55,6.23 38.17,7.61 U$4.42 37.67,8.11
N$19
  Bottom 0.305: D1.C 40.72,11.91 | 39.61,11.91 L1.1
  Bottom 0.406: 33.22,11.21 LT3426.5
  pour Bottom (isolate 0.305, no thermals): 31.39,12.9 30.4,12.9 30.4,9.73 41.76,9.73 41.76,12.37 41.68,12.4 40.44,12.4 40.44,11.96 39.14,11.96 39.09,10.24 33.38,10.24 33.38,11.91 33.05,11.91 33.05,10.41 31.39,10.41
N$20  (1 unrouted)
  Top 0.305: C5.2 37.54,13.23 37.03,12.73 U$4.6
N$21
  Bottom 0.61: 26.85,14.54 U$6.2
  Bottom 0.711: U$5.5 26.85,14.54
N$22
  Bottom 0.61: D2.C R17.1
N$23  (via drill 0.35)
  Top 0.305: U1.3 34.44,15.83 34.42,15.8 33.35,15.8 33.1,16.05 v32.97,16.05
  Bottom 0.305: v32.97,16.05 32.68,16.05 R18.2
N$27
  Top 0.305: R6.1 31.78,3.86 32,3.63 33.12,3.63 33.71,3.05 PTT.A
N$28
  Top 0.305: U1.7 R19.2
P$1  (via drill 0.35)
  Bottom 0.152: v49.71,14.43 49.73,14.43 v50.34,13.82 | v50.34,13.82 50.34,13.84 v50.93,14.43 | v50.93,13.21 50.93,13.23 v50.34,13.82 | v50.34,13.82 50.32,13.82 v49.71,13.21 | v49.71,11.91 v50.34,11.28 | v50.34,11.28 50.34,11.3 v50.93,11.89 | v50.34,11.28 50.34,11.25 v50.93,10.67 | v50.34,11.28 50.32,11.28 v49.71,10.67
  Bottom 0.61: v49.71,13.21 v49.71,11.91 | v50.93,11.89 v50.93,13.21
PPS
  Top 0.305: R1.1 16,17.96 15.25,17.2 U$1.4_TIMEPULSE
RFGND  (via drill 0.35, 1 pad 1.68)
  Bottom 0.61: 50.32,7.06 J$1.GND@1
  other vias: 41.48,3.38 42.24,4.14 43,4.9 44.53,6.43 45.29,7.19 46.3,7.19 47.32,7.16 50.93,1.55
  pour Top (isolate 0.508, no thermals): 52.32,7.39 45.29,7.42 40.49,2.59 40.46,0.03 52.32,0.03
  pour Bottom (isolate 0.61, no thermals): 52.27,7.34 45.21,7.34 40.59,2.62 40.59,0.1 52.3,0.03
  pour Route2 (rank 2, no thermals): 40.61,0 52.25,0 52.25,7.34 45.26,7.34 40.54,2.59 40.54,0.05
RFOUT  (via drill 1 pad 1.68)
  other vias: 50.93,4.09
RX  (1 unrouted)
  Top 0.305: U$4.20 30.24,11.3 29.98,11.56 28.88,11.56 28.27,10.95 R16.1
RX1  (via drill 0.6)
  Top 0.305: U$1.2_TXD1 17.45,17.14 17.78,17.48 19.28,17.48 20.01,16.74 v20.01,16.15 | v25.63,11.76 25.63,11.18 25.86,10.95 R16.2
  Route15 0.305: v20.01,16.15 21.95,14.22 23.69,14.22 24.2,13.71 24.2,13.19 v25.63,11.76
SCK
  Top 0.305: FTDI.6 36.6,17.27 36.6,16.48 37.25,15.83 U1.6 37.66,15.76 38.01,15.76 38.17,15.59 38.17,15.06 38,14.88 37.07,14.88 U$4.9
SCL  (via drill 0.6)  (3 unrouted)
  Top 0.305: U$4.18 30.89,12.07 30.15,12.8 28.85,12.8 v28.79,12.87 28.63,12.88 27.42,14.06 | 27.42,14.06 R7.2 27.42,14.06
  Bottom 0.305: U$3.5 30.98,2.49 31.9,3.4 32.87,3.4 33.45,3.99 33.45,5.13 30.84,7.75 29.21,7.75 28.79,8.17 v28.79,12.87 28.77,12.85 27.41,12.85 26.95,12.39 26.95,11.74 27.46,11.24 27.46,7.19 27.33,7.06 26.93,7.06 26.7,7.29 IC1.4
SDA  (via drill 0.6)  (3 unrouted)
  Top 0.305: U$4.19 30.65,11.6 30.18,12.07 v27.74,12.07 26.82,12.98 26.6,13.22 | 26.6,13.22 R3.2 26.39,13.43 26.6,13.22
  Bottom 0.305: 27.74,12.09 v27.74,12.07 28.12,11.68 28.12,7.85 28.83,7.14 | 28.83,7.14 30.53,7.14 31.44,6.22 31.44,5.08 28.98,2.59 U$3.6 | 28.83,7.14 28.83,7.04 28.3,6.5 26.57,6.5 IC1.3
SS  (via drill 0.35)
  Top 0.305: v33.98,16.84 33.82,16.83 U1.1 | U$4.8 37.35,14.45 38.62,14.45 39.77,15.6 41.07,15.6 41.23,15.77 41.23,17.18 40.87,17.55 40.56,17.55 FTDI.7
  Bottom 0.305: FTDI.7 38.17,16.84 v33.98,16.84
TX  (1 unrouted)
  Top 0.305: U$4.21 30.03,10.8 29.76,11.07 29.41,11.07 28.47,10.13 26.06,10.13 25.65,9.73 23.75,9.73 23.34,10.13 R15.2
TX1  (via drill 0.6)
  Top 0.305: U$1.3_RXD1 16.36,17.27 16.99,17.91 v20.14,17.91 20.85,17.2 20.85,12.29 21.15,12.02 21.37,11.8 R14.1 23.22,11.75 R15.1
VBACKUP  (via drill 0.6)
  Top 0.61: U$1.6_V_BCKP 13.05,17.11 13.06,17.12 13.06,17.3 v13.08,17.32
  Bottom 0.61: R17.2 10.96,9.26 | 10.96,9.26 11.53,9.83 11.53,15.21 13.1,16.78 | 13.1,16.78 C3.1 | v13.08,17.32 13.1,17.3 13.1,16.78 | C17.2 10.95,9.25 10.96,9.26
VCC  (via drill 0.35, 0.6)  (10 unrouted)
  Top 0.305: 37.19,9.47 37.72,9.47 38.01,9.18 U$4.44 38.51,8.69 39.06,8.69 39.95,9.4 40.33,9.4 C2.2 | 37.19,9.47 34.05,6.34 34.05,6.01 34.55,5.51 U$4.34 35.08,5.05 35.08,4.8 34.44,4.17 v34.37,4.17 | FTDI.2 30.04,18.4 31.85,16.56 31.85,13.93 32.28,13.51 U$4.14 33.45,12.32 33.45,11.58 30.96,9.09 30.57,9.09 U$4.24 30.15,8.69 29.64,8.18 28.61,8.18 28.3,7.87 C4.2 | 37.44,10.31 U$4.2 37.44,10.31 | 37.44,10.31 37.19,10.05 37.19,9.47 | U$4.7 36.62,13.02 | 37.44,10.31 | 40.6,14.62 v40.39,14.4 39.95,13.96 37.56,13.96 36.62,13.02 | U1.8 38.6,16.83 38.84,17.06 39.87,17.06 R19.1 | 36.62,13.02
  Top 0.406: 23.85,3.9 U$2.VCC | F1.2 40.92,13.87 v40.39,14.4 | C10.2 23.84,3.47
  Top 0.61: 23.85,3.9 23.85,4.05 C10.2 | F1.2 42.15,15.15 C9.2
  Bottom 0.203: 23.39,16.46 23.38,16.44
  Bottom 0.254: U$5.1 23.43,14.54 23.65,14.76 23.65,16.21 23.39,16.46 | 23.38,16.44 U$5.3
  Bottom 0.305: FTDI.2 30.61,17.5 R5.2
  Bottom 0.61: L1.2 39.47,13.49
  Bottom 0.813: 39.47,13.49 v40.39,14.4
  other vias: 22.89,17.45 40.61,16.94
  pour Route15: 52.32,19.56 25.93,19.61 19.96,19.56 8.38,19.56 8.38,4.04 12.34,4.04 12.34,0.13 39.88,0 39.9,0.03 39.9,2.92 44.96,7.98 52.25,7.98
  pour Bottom (rank 2, no thermals): 23.29,17.83 20.88,17.83 20.88,16.26 23.29,16.26
VIN  (1 unrouted)
  Top 0.305: R13.1 39.19,4.52 39.55,4.52 46.23,11.2 J1.2
  Bottom 0.406: R8.2 34.15,12.96 LT3426.6 34.59,11.68 L2.1 37.63,12.3
  Bottom 0.61: C8.1 37.63,12.3
  pour Bottom (isolate 0.305, rank 2, no thermals): 40.39,14.43 39.5,14.43 38.53,13.51 38.56,10.85 34.01,10.85 34.01,12.09 33.76,12.52 33.76,13.31 37.34,13.26 37.39,15.06 38.02,15.09 38.33,15.37 39.45,16.51 43.36,16.51 45.67,16.48 47.27,16.48 47.32,14.5 44.22,14.45 43.23,14.48
VSENSE  (3 unrouted)
  Top 0.254: C6.2 39.57,3.28 39.34,3.51
  Top 0.305: R13.2 37.69,6.02 37.69,7.39 37.49,7.6 37.48,7.6 37.32,7.76 | 37.32,7.76 U$4.41 37.32,7.76 | 37.32,7.76
  Top 0.406: R13.2 37.46,5.54 37.46,5.08 38.69,3.86 38.99,3.86 39.34,3.51 39.5,3.35 C6.2
XTAL1  (1 unrouted)
  Top 0.305: U$4.17 31.37,12.29 30.3,13.37 29.63,13.85 Y1.1
XTAL2  (1 unrouted)
  Top 0.305: U$4.16 31.7,12.67 30.84,13.53 30.84,14.3 31.33,14.79 31.33,15.55 Y1.3

### Text on the board
tNames: GND | TX | 3V | 5V | MISO | SS | !RESET | RX | SCK | MOSI | SPI
bNames: + | I2C | Tracksoar v2 | SDA | SCL | D8 | D9 | A0 | A1 | <3 Swiss